# Altium project MIDDLE.PrjPcb
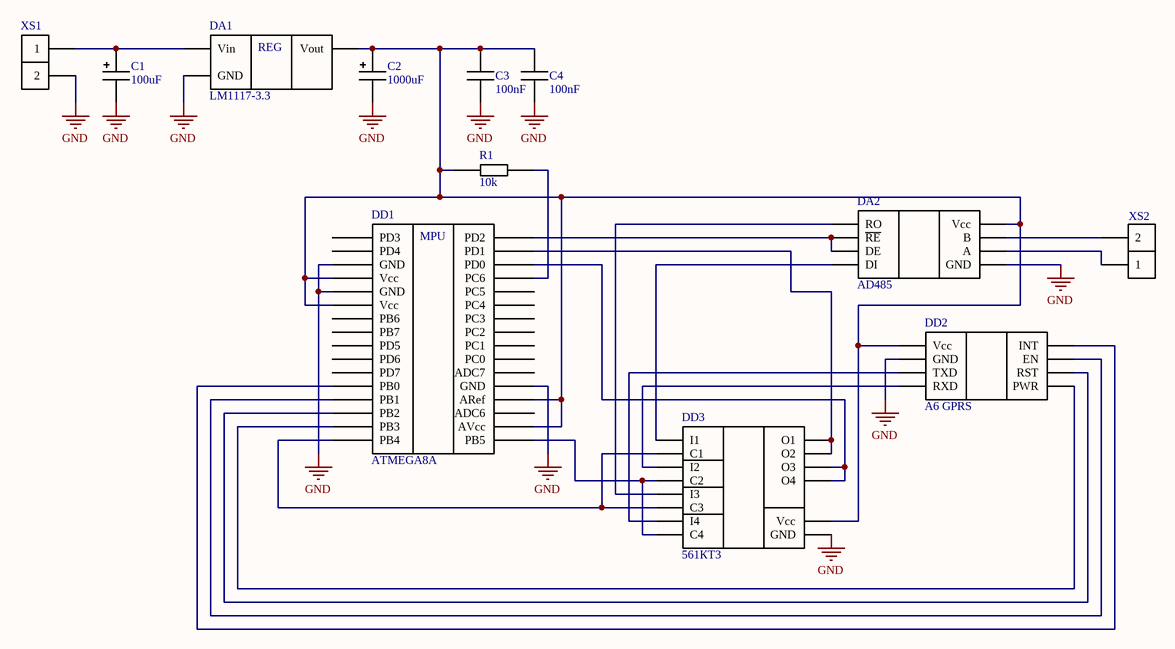
[diagram p0: middle.SchDoc]
1 sheet, 12 parts. Net scope: global (net labels, ports and power ports of the same name join across sheets).
Board file: middle.PcbDoc

## Sheet middle.SchDoc
size A4

### Parts
C1  100uF
C2  1000uF
C3  100nF
C4  100nF
DA1  LM1117-3.3
DA2  AD485
DD1  ATMEGA8A
DD2  A6 GPRS
DD3  561КТ3
R1  10k
XS1  CONN-2  (value not drawn)
XS2  CONN-2  (value not drawn)

### Nets
GND: C1.2 C2.2 C3.2 C4.2 DA1.3(GND) DA2.5(GND) DD1.3(GND) DD1.5(GND) DD1.21(GND) DD2.2(GND) DD3.7(GND) XS1.2
NetC1_1: C1.1 DA1.1(Vin) XS1.1
NetC2_1: C2.1 C3.1 C4.1 DA1.2(Vout) DA2.8(Vcc) DD1.4(Vcc) DD1.6(Vcc) DD1.18(AVcc) DD1.20(ARef) DD2.1(Vcc) DD3.14(Vcc) R1.2
NetDA2_1: DA2.1(RO) DD3.4(I3)
NetDA2_2: DA2.2(~{RE}) DA2.3(DE) DD1.32(PD2)
NetDA2_4: DA2.4(DI) DD3.1(I1)
NetDA2_6: DA2.6(A) XS2.1
NetDA2_7: DA2.7(B) XS2.2
NetDD1_12: DD1.12(PB0) DD2.8(INT)
NetDD1_13: DD1.13(PB1) DD2.7(EN)
NetDD1_14: DD1.14(PB2) DD2.6(RST)
NetDD1_15: DD1.15(PB3) DD2.5(PWR)
NetDD1_16: DD1.16(PB4) DD3.2(C1) DD3.5(C3)
NetDD1_17: DD1.17(PB5) DD3.6(C4) DD3.12(C2)
NetDD1_29: DD1.29(PC6) R1.1
NetDD1_30: DD1.30(PD0) DD3.3(O3) DD3.9(O4)
NetDD1_31: DD1.31(PD1) DD3.2(O1) DD3.10(O2)
NetDD2_3: DD2.3(TXD) DD3.8(I4)
NetDD2_4: DD2.4(RXD) DD3.11(I2)

Not connected (* = marked no-connect by the designer): DD1 1(PD3) 2(PD4) 7(PB6) 8(PB7) 9(PD5) 10(PD6) 11(PD7) 19(ADC6) 22(ADC7) 23(PC0) 24(PC1) 25(PC2) 26(PC3) 27(PC4) 28(PC5)

### Notes on the sheet
- (in symbol ATMEGA8A) MPU
- (in symbol LM1117-3.3) REG

### Library data of the parts
C1 C2 = CAP_POLAR
C3 C4 = CAP_NONPOLAR
R1 = RES